# EAGLE design PowerPlayground (EAGLE 8.2.2)
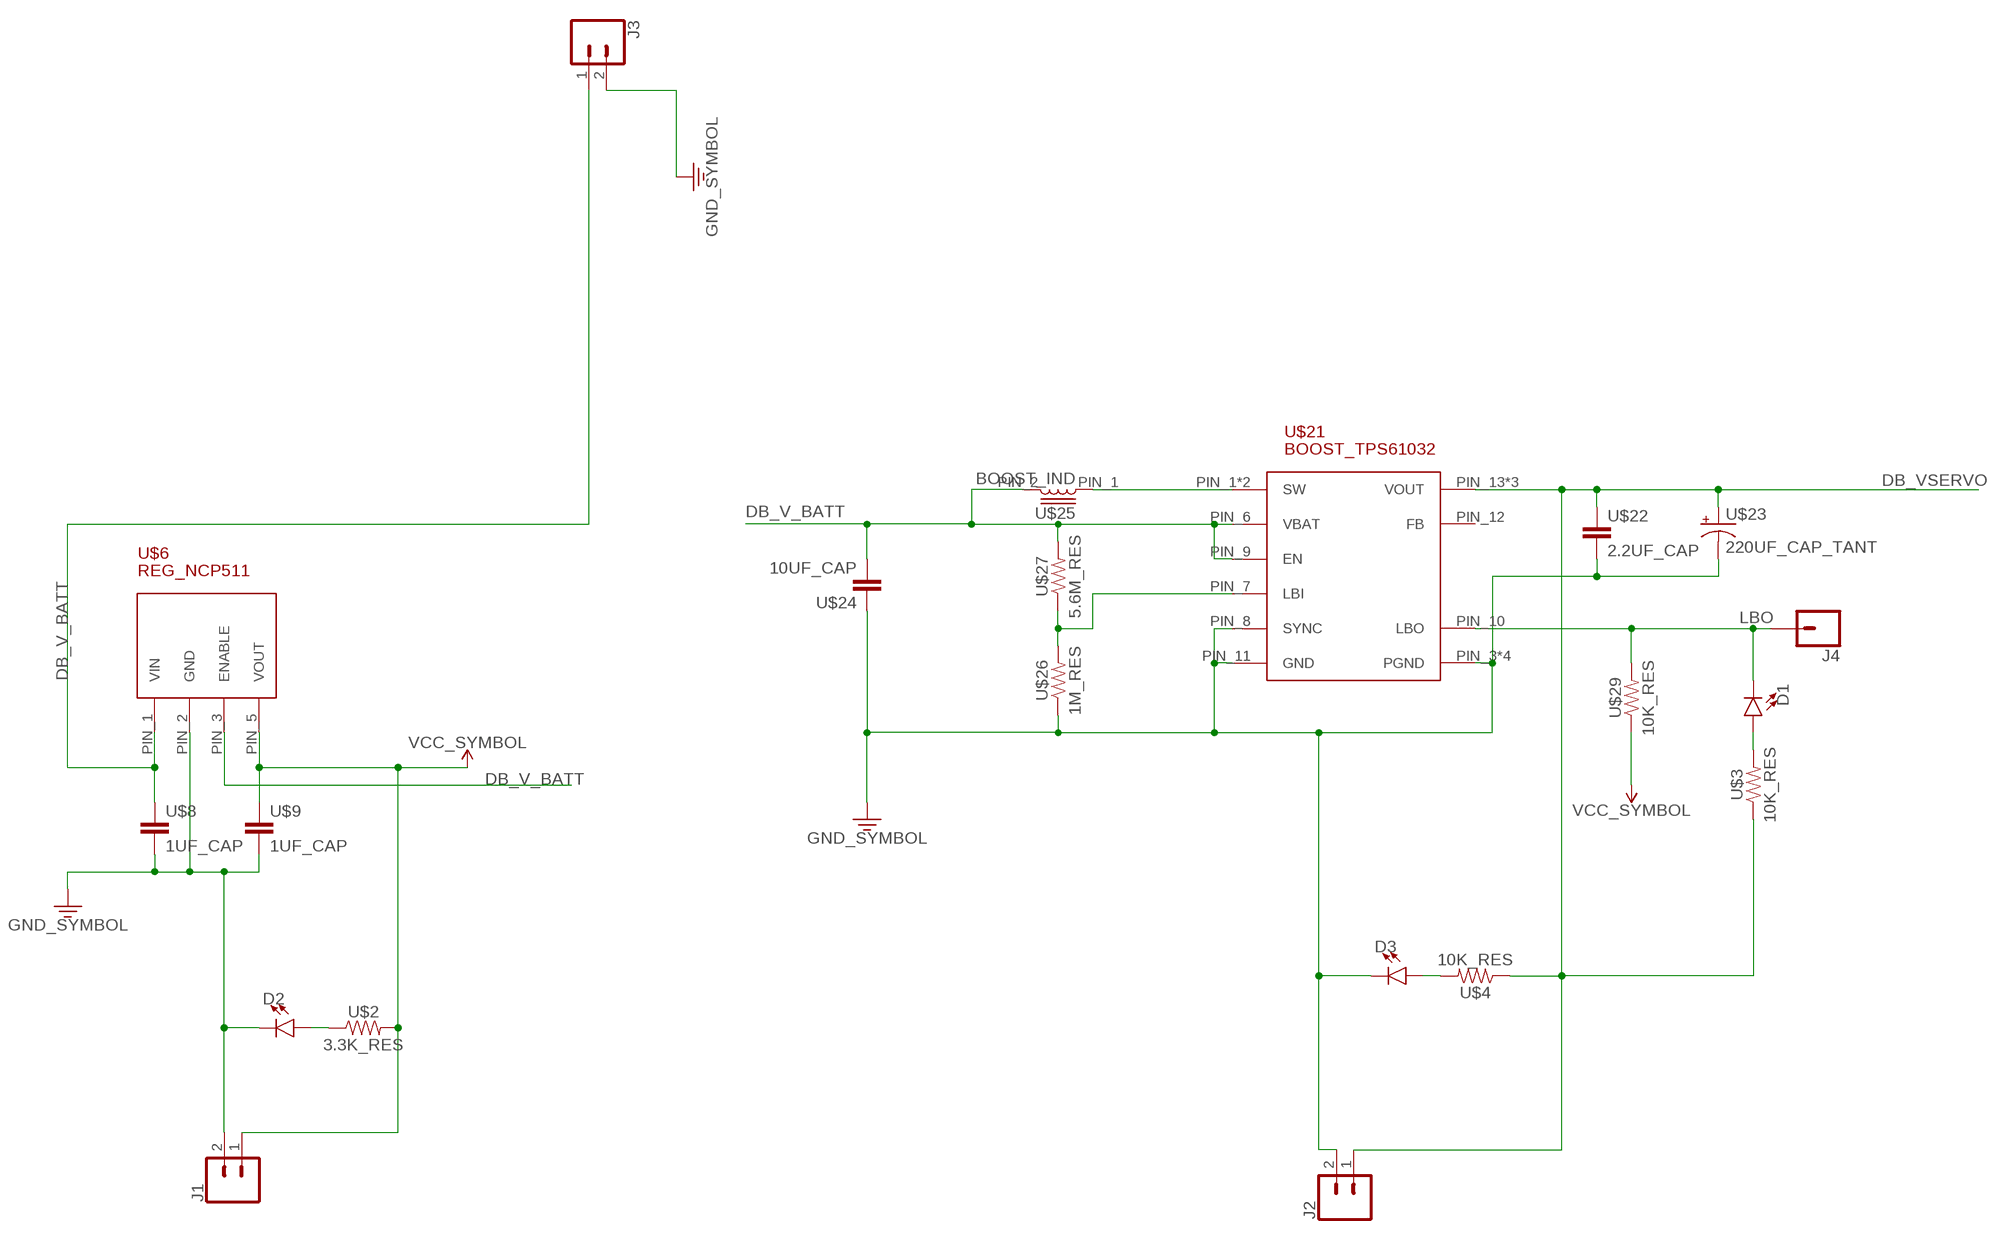
[diagram p0: schematic, sheet 1]

## Parts
D1  LED5MM  [LED_5MM]
D2  LED5MM  [LED_5MM]
D3  LED5MM  [LED_5MM]
J1  CONN_02PTH3  [1X02_LONGPADS]
J2  CONN_02PTH3  [1X02_LONGPADS]
J3  CONN_02PTH3  [1X02_LONGPADS]
J4  CONN_01OFFSET  [1X01_OFFSET]
U$2  3.3K_RES  [0603]
U$3  10K_RES  [0603]
U$4  10K_RES  [0603]
U$6  REG_NCP511  [TSOP-5]
U$8  1UF_CAP  [0603]
U$9  1UF_CAP  [0603]
U$21  BOOST_TPS61032  [PWP-16]
U$22  2.2UF_CAP  [0603]
U$23  220UF_CAP_TANT  [7343]
U$24  10UF_CAP  [0603]
U$25  BOOST_IND  [VLS6045EX]
U$26  1M_RES  [0603]
U$27  5.6M_RES  [0603]
U$29  10K_RES  [0603]

## Nets
DB_V_BATT: J3.1 U$6.PIN_1(VIN) U$6.PIN_3(ENABLE) U$8.1 U$21.PIN_6(VBAT) U$21.PIN_9(EN) U$24.2 U$25.PIN_2 U$27.2
DB_VSERVO: J2.1 U$3.1 U$4.1 U$21.PIN_13(VOUT) U$21.PIN_14(VOUT) U$21.PIN_15(VOUT) U$22.1 U$23.PIN_2_+(+)
GND: D2.K(C) D3.K(C) J1.2 J2.2 J3.2 U$6.PIN_2(GND) U$8.2 U$9.2 U$21.PIN_3(PGND) U$21.PIN_4(PGND) U$21.PIN_5(PGND) U$21.PIN_8(SYNC) U$21.PIN_11(GND) U$21.PIN_17(PGND) U$22.2 U$23.PIN_1_-(-) U$24.1 U$26.1 ; supply symbol labelled GND_SYMBOL
LBO: D1.K(C) J4.1 U$21.PIN_10(LBO) U$29.2
N$1: D2.A U$2.1
N$2: U$21.PIN_7(LBI) U$26.2 U$27.1
N$3: U$21.PIN_1(SW) U$21.PIN_2(SW) U$25.PIN_1
N$4: D3.A U$4.2
N$5: D1.A U$3.2
VCC: J1.1 U$2.2 U$6.PIN_5(VOUT) U$9.1 U$29.1 ; supply symbol labelled VCC_SYMBOL
Unconnected: U$21.PIN_12(FB)

## Library data of the parts
D1-D3 = SparkFun-LED:LED: LED (Generic) Standard schematic elements and footprints for 5mm, 3mm, 1206, and 0603 sized LEDs. Generic LEDs with no color specified.
J1-J3 = SparkFun-Connectors:CONN_02: Multi connection point. Often used as Generic Header-pin footprint for 0.1 inch spaced/style header connections On any of the 0.1 inch spaced packages, you can populate with these: Break Away Headers - Straight <https://www.sparkfun.com/products/116> (PRT-00116) Break Away Male Headers - Right Angle <https://www.sparkfun.com/products/553> (PRT-00553) Female Headers <https://www.sparkfun.com/products/115> (PRT-00115) Break Away Headers - Machine Pin <https://www.sparkfun.com/products/117> (PRT-00117) Break Away Female Headers - Swiss Machine Pin <https://www.sparkfun.com/products/743> (PRT-00743) For SCREWTERMINALS and SPRING TERMINALS visit here: Screw Terimnals on SparkFun.com <https://www.sparkfun.com/search/results?term=Screw+Terminals> (5mm/3.5mm/2.54mm spacing) This device is also useful as a general connection point to wire up your design to another part of your project. Our various solder wires solder well into these plated through hole pads. Hook-Up Wire - Assortment (Stranded, 22 AWG) <https://www.sparkfun.com/products/11375> (PRT-11375) Hook-Up Wire - Assortment (Solid Core, 22 AWG) <https://www.sparkfun.com/products/11367> (PRT-11367) View the entire wire category on our website here <https://www.sparkfun.com/categories/141> Special notes: Molex polarized connector foot print use with: PRT-08233 with associated crimp pins and housings. 2.54_SCREWTERM for use with PRT-10571. 3.5mm Screw Terminal footprints for PRT-08084 5mm Screw Terminal footprints for use with PRT-08432
J4 = SparkFun-Connectors:CONN_01: Single connection point. Often used as Generic Header-pin footprint for 0.1 inch spaced/style header connections On any of the 0.1 inch spaced packages, you can populate with these: Break Away Headers - Straight <https://www.sparkfun.com/products/116> (PRT-00116) Break Away Male Headers - Right Angle <https://www.sparkfun.com/products/553> (PRT-00553) Female Headers <https://www.sparkfun.com/products/115> (PRT-00115) Break Away Headers - Machine Pin <https://www.sparkfun.com/products/117> (PRT-00117) Break Away Female Headers - Swiss Machine Pin <https://www.sparkfun.com/products/743> (PRT-00743) This device is also useful as a general connection point to wire up your design to another part of your project. Our various solder wires solder well into these plated through hole pads. Hook-Up Wire - Assortment (Stranded, 22 AWG) <https://www.sparkfun.com/products/11375> (PRT-11375) Hook-Up Wire - Assortment (Solid Core, 22 AWG) <https://www.sparkfun.com/products/11367> (PRT-11367) View the entire wire category on our website here <https://www.sparkfun.com/categories/141> Special notes: SMTSO-256-ET is a "flush mount" nut for a 4-40 screw. We mostly use this on specialty testbeds; it is a nice way to connect hardware to your PCB at an adjustable hieght. Also note, the SNAP packages are for using a snappable style connector. We sell a baggie of snaps and they are also used on two LilyPad designs: Snap Assortment - 30 pack (male and female) <https://www.sparkfun.com/products/11347> (DEV-11347) LilyPad Arduino SimpleSnap <https://www.sparkfun.com/products/10941> (DEV-10941) LilyPad SimpleSnap Protoboard <https://www.sparkfun.com/products/10940> (DEV-10940)
U$2 = SNWCT_EAGLE_LBR:3.3K_RES
U$3 U$4 U$29 = SNWCT_EAGLE_LBR:10K_RES
U$6 = SNWCT_EAGLE_LBR:REG_NCP511
U$8 U$9 = SNWCT_EAGLE_LBR:1UF_CAP
U$21 = SNWCT_EAGLE_LBR:BOOST_TPS61032
U$22 = SNWCT_EAGLE_LBR:2.2UF_CAP
U$23 = SNWCT_EAGLE_LBR:220UF_CAP_TANT
U$24 = SNWCT_EAGLE_LBR:10UF_CAP
U$25 = SNWCT_EAGLE_LBR:BOOST_IND
U$26 = SNWCT_EAGLE_LBR:1M_RES
U$27 = SNWCT_EAGLE_LBR:5.6M_RES

## Board
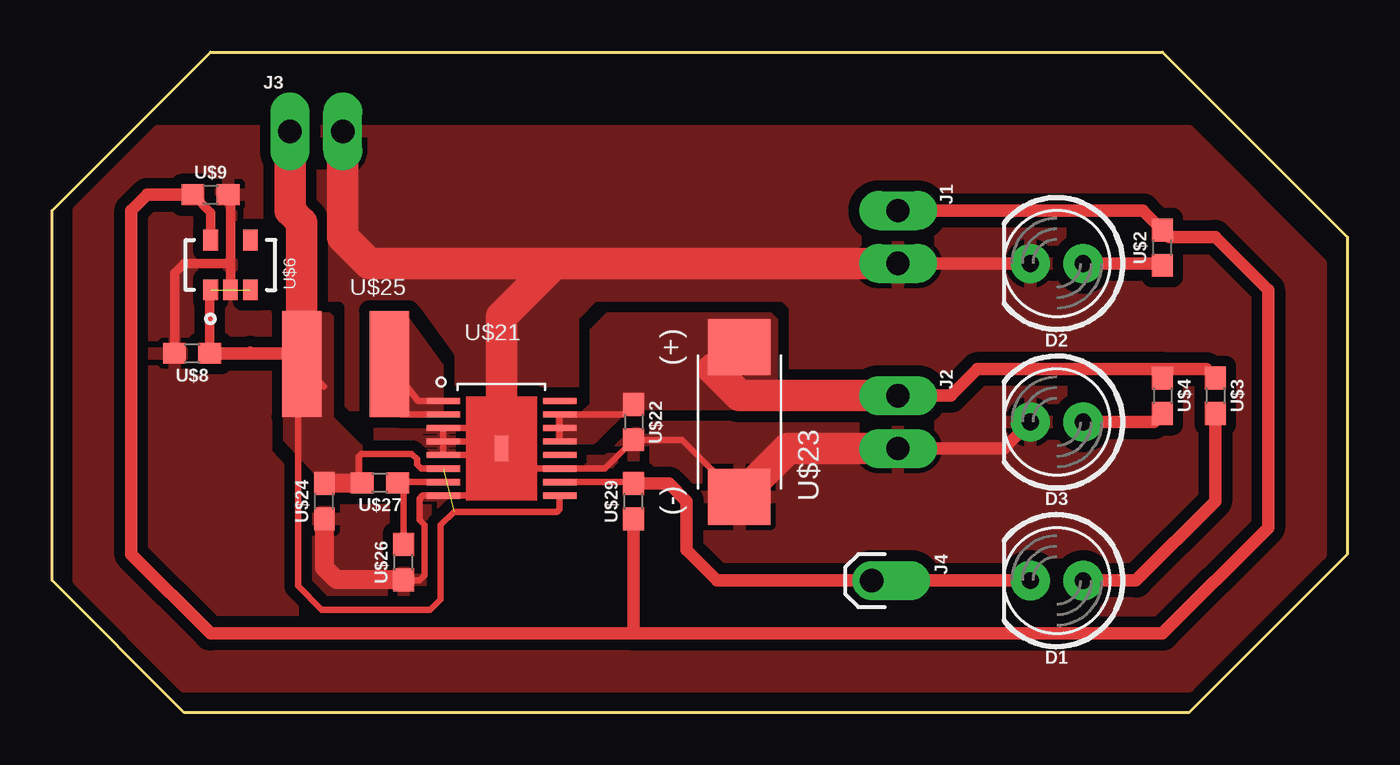
[diagram p1: board, top side]
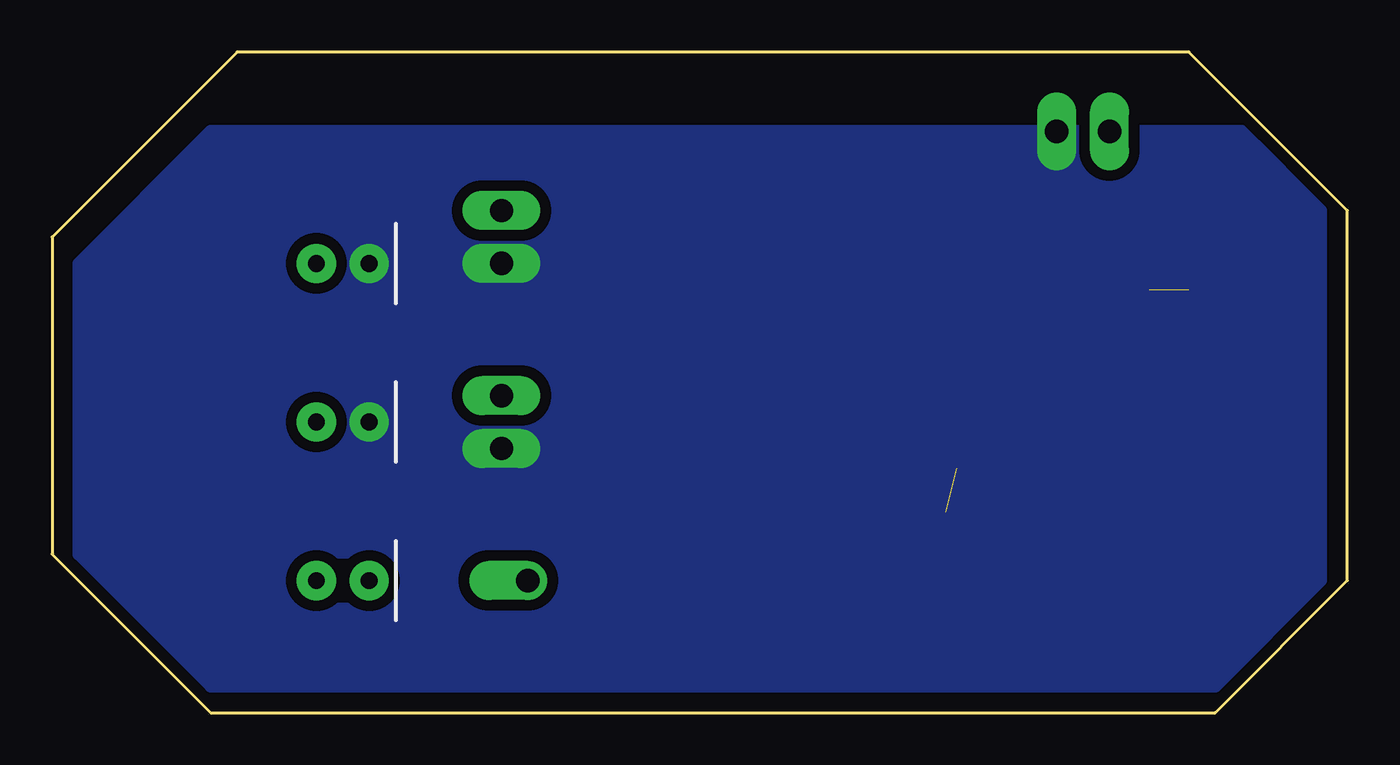
[diagram p2: board, bottom side, seen from below]

Size 62.23 x 31.75 mm. Coordinates in mm from the lower left corner, seen from the top.
Outline: 0,24.13 7.62,31.75 53.34,31.75 62.23,22.86 62.23,7.62 54.61,0 6.35,0 0,6.35 0,24.13
Copper layers (1*16): Top 0.035mm / dielectric 1.5mm / Bottom 0.035mm
Design rules "SeeedStudio_2layer_DRU_no_angle_20140221": minimum track width 6mil, minimum drill 12mil, track to track 6mil, track to pad 6mil, pad to pad 6mil, via to via 6mil, smd to smd 0mil, copper to edge 10mil, drill to drill 10mil, minimum pad ring 10mil, minimum via ring 6mil, stop-mask expansion 2mil, vias tented up to drill 100mil, thermal gap 10mil

### Footprints (pad centres in the part's own frame; a part is rotated, then mirrored left to right if it is on the bottom)
LED_5MM = drill 0.813 pad 1.88: A -1.27,0; K 1.27,0
1X02_LONGPADS = drill 1.118 pad 1.88 long: 1 0,0; 2 2.54,0
1X01_OFFSET = drill 1.118 pad 1.88 offset: 1 0,0
0603 = smd 1.1 x 1: 1 -0.85,0; 2 0.85,0
TSOP-5 = smd 0.7 x 1: PIN_1 0,0; PIN_2 0.95,0; PIN_3 1.9,0; PIN_4 1.9,2.4; PIN_5 0,2.4
PWP-16 = smd 0.3 x 1.6: PIN_1 -2.283,-2.8; PIN_2 -1.633,-2.8; PIN_3 -0.983,-2.8; PIN_4 -0.333,-2.8; PIN_5 0.317,-2.8; PIN_6 0.967,-2.8; PIN_7 1.617,-2.8; PIN_8 2.267,-2.8; PIN_9 2.267,2.8; PIN_10 1.617,2.8; PIN_11 0.967,2.8; PIN_12 0.317,2.8; PIN_13 -0.333,2.8; PIN_14 -0.983,2.8; PIN_15 -1.633,2.8; PIN_16 -2.283,2.8 | smd 1.27 x 0.635: PIN_17 0,0
7343 = smd 2.7 x 3: PIN_1_- -3.6,0; PIN_2_+ 3.6,0
VLS6045EX = smd 1.9 x 5.1: PIN_1 -2.1,0; PIN_2 2.1,0

### Placement (x,y rotation side)
D1  48.26,6.35 180 top
D2  48.26,21.59 180 top
D3  48.26,13.97 180 top
J1  40.64,24.13 270 top
J2  40.64,15.24 270 top
J3  11.43,27.94 0 top
J4  39.37,6.35 270 top
U$2  53.34,22.35 90 top
U$3  55.88,15.24 270 top
U$4  53.34,15.24 270 top
U$6  7.62,20.32 0 top
U$8  6.73,17.27 180 top
U$9  7.62,24.89 0 top
U$21  21.59,12.7 270 top
U$22  27.94,13.97 270 top
U$23  33.02,13.97 90 top
U$24  13.08,10.16 90 top
U$25  14.1,16.76 180 top
U$26  16.89,7.24 90 top
U$27  15.75,11.05 180 top
U$29  27.94,10.16 90 top

### Tracks (layer width: path | path; a pad name or v marks a point on that pad's centre or on a via)
DB_V_BATT  (2 unrouted)
  Top 0.305: 13.08,15.68 U$25.PIN_2 11.81,16.58 11.81,6.1 12.95,4.95 18.16,4.95 18.67,5.46 18.67,9.02 19.3,9.65 24.26,9.65 24.39,9.79 U$21.PIN_9 | U$21.PIN_6 17.73,11.73 17.53,11.94 17.53,12.19 17.27,12.45 14.86,12.45 14.73,12.32 14.73,11.21 U$27.2
  Top 0.457: U$6.PIN_1 7.58,20.28 U$8.1 9.4,17.27 9.52,17.39
  Top 0.61: U$8.1 11.49,17.27 U$25.PIN_2
  Top 0.914: U$27.2 14.86,11.01 U$24.2
  Top 1.524: U$25.PIN_2 12,23.56 11.43,24.13 J3.1
  pour Top (no thermals): 12.7,11.43 11.18,13.08 11.18,19.18 13.33,19.18 13.46,19.05 13.46,14.22 14.86,12.83 14.86,11.43
DB_VSERVO
  Top 0.305: U$21.PIN_13 U$21.PIN_14 U$21.PIN_15 27.45,14.33 U$22.1
  Top 0.61: J2.1 43.18,15.24 44.45,16.51 53.46,16.51 | 53.46,16.51 55.46,16.51 U$3.1 | U$4.1 53.34,16.39 53.46,16.51
  Top 1.524: J2.1 33.02,15.24 31.75,16.51 31.96,16.51 U$23.PIN_2_+
  pour Top (no thermals): 24.26,12.95 24.26,14.35 25.4,14.35 25.91,14.86 25.91,18.41 26.67,19.18 34.54,19.18 34.8,18.92 34.8,14.86 34.54,14.61 27.69,14.61 26.16,13.08 26.03,12.95
GND
  Top 0.305: U$21.PIN_4 U$21.PIN_5 21.27,12.38 U$21.PIN_17 | U$21.PIN_4 U$21.PIN_3 20.61,13.68 U$21.PIN_17 | U$21.PIN_17 21.26,13.03 U$21.PIN_4 | U$21.PIN_17 22.56,11.73 U$21.PIN_11 26.55,11.73 U$22.2 30.27,13.12 U$23.PIN_1_- | U$21.PIN_17 21.59,11.05 20.97,10.43 U$21.PIN_8 17.8,10.43 17.65,10.29 17.65,9.27 17.91,9.02 17.91,6.6 17.65,6.35 16.93,6.35 U$26.1
  Top 0.457: U$6.PIN_2 8.57,21.57 | 8.57,21.57 8.57,24.79 U$9.2 | U$8.2 5.88,21.12 6.35,21.59 8.55,21.59 8.57,21.57
  Top 0.61: J2.2 45.72,12.7 D3.K | J1.2 D2.K
  Top 0.914: U$26.1 13.68,6.39 13.08,6.99 U$24.1
  Top 1.524: J2.2 35.35,12.7 U$23.PIN_1_- | U$21.PIN_17 21.59,19.05 24.13,21.59 J1.2 15.24,21.59 13.97,22.86 J3.2
  pour Top (isolate 0.508, rank 6): 1.27,24.13 5.08,27.94 54.61,27.94 60.96,21.59 60.96,7.62 54.61,1.27 7.62,1.27 6.35,1.27 1.27,6.35
  pour Bottom (isolate 0.508, rank 6, no thermals): 1.27,24.13 5.08,27.94 54.61,27.94 60.96,21.59 60.96,7.62 54.61,1.27 6.35,1.27 1.27,6.35
LBO
  Top 0.305: U$21.PIN_10 27.87,11.08 U$29.2
  Top 0.61: D1.K J4.1 31.95,6.35 30.48,7.82 30.48,10.16 29.63,11.01 U$29.2
N$1
  Top 0.61: D2.A 53.25,21.59 U$2.1
N$2
  Top 0.305: 16.63,11.08 U$21.PIN_7 | 16.63,11.08 U$27.1 | U$26.2 16.89,10.82 16.63,11.08
N$3
  Top 0.305: U$21.PIN_1 17.6,14.98 U$25.PIN_1 16.38,16.2 16.38,14.73 16.78,14.33 U$21.PIN_2
  pour Top (no thermals): 18.67,14.35 15.49,14.35 15.49,18.92 17.02,18.92 18.67,16.64
N$4
  Top 0.61: D3.A 52.92,13.97 U$4.2
N$5
  Top 0.61: U$3.2 55.88,10.16 52.07,6.35 D1.A
VCC
  Top 0.457: U$6.PIN_5 7.62,24.04 U$9.1
  Top 0.61: J1.1 52.41,24.13 U$2.2 53.68,22.86 55.88,22.86 58.42,20.32 58.42,8.89 53.34,3.81 27.95,3.81 | 27.95,3.81 7.62,3.81 3.81,7.62 3.81,24.13 4.57,24.89 U$9.1 | U$29.1 27.94,3.83 27.95,3.81